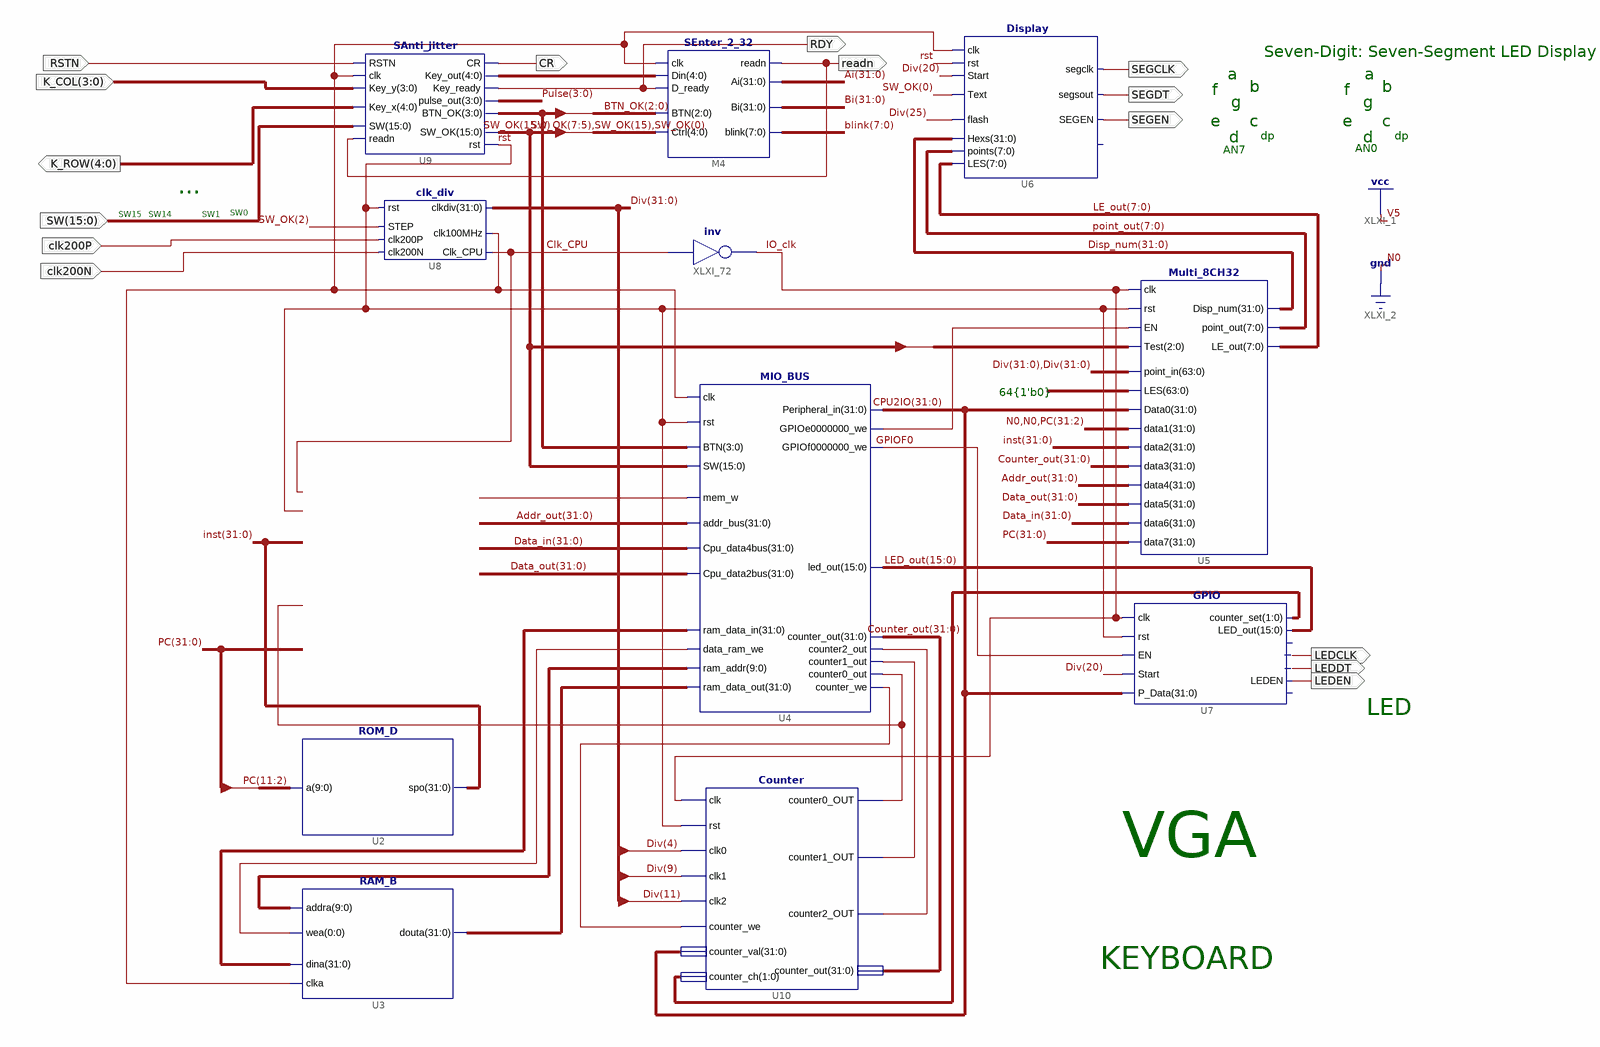
[diagram p0: schematic sheet 1]
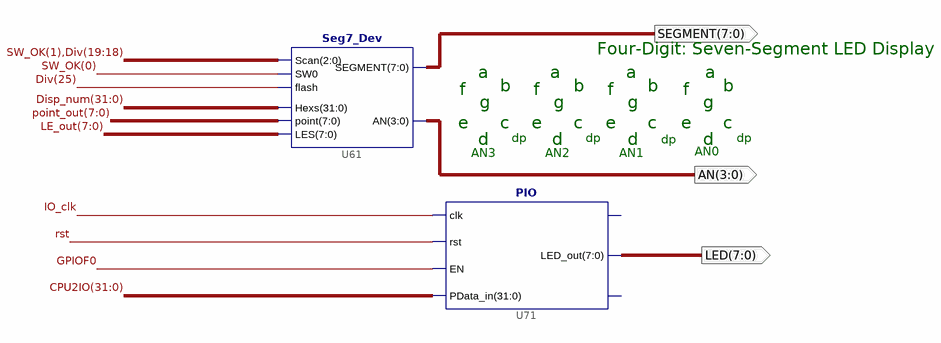
[diagram p1: schematic sheet 2]
// Xilinx ISE schematic OExp05_DataPath.sch (kintex7) as structural Verilog: 13 symbols, 18 ports
module OExp05_DataPath (
  input  [15:0] SW,
  input  [3:0] K_COL,
  input  RSTN,
  input  clk200P,
  input  clk200N,
  output [7:0] SEGMENT,
  output [3:0] AN,
  output readn,
  output RDY,
  output [4:0] K_ROW,
  output CR,
  output [7:0] LED,
  output LEDCLK,
  output LEDDT,
  output LEDEN,
  output SEGCLK,
  output SEGDT,
  output SEGEN
);

  wire clk_100mhz, Clk_CPU, GPIOF0, IO_clk, rst, XLXN_153, XLXN_154, XLXN_541, XLXN_544, XLXN_560, XLXN_579;
  wire [0:0] XLXN_557;
  wire [1:0] XLXN_219;
  wire [3:0] BTN_OK, Pulse;
  wire [4:0] XLXN_444;
  wire [7:0] blink, LE_out, point_out;
  wire [9:0] XLXN_558;
  wire [15:0] LED_out, SW_OK;
  wire [31:0] Addr_out, Ai, Bi, Counter_out, CPU2IO, Data_in, Data_out, Disp_num, Div, inst, PC, XLXN_556,
       XLXN_559;

  not XLXI_72 (IO_clk, Clk_CPU);
  ROM_D U2 (.a(PC[11:2]), .spo(inst));
  RAM_B U3 (.addra(XLXN_558), .clka(clk_100mhz), .wea(XLXN_557[0]), .dina(XLXN_556), .douta(XLXN_559));
  MIO_BUS U4 (
    .rst(rst), .clk(clk_100mhz), .mem_w(XLXN_544), .addr_bus(Addr_out), .Cpu_data4bus(Data_in),
    .Cpu_data2bus(Data_out), .ram_data_out(XLXN_559), .ram_addr(XLXN_558), .data_ram_we(XLXN_557[0]),
    .ram_data_in(XLXN_556), .counter_out(Counter_out), .counter2_out(XLXN_154), .counter1_out(XLXN_153),
    .counter0_out(XLXN_579), .counter_we(XLXN_560), .BTN(BTN_OK), .SW(SW_OK), .led_out(LED_out),
    .Peripheral_in(CPU2IO), .GPIOe0000000_we(XLXN_541), .GPIOf0000000_we(GPIOF0));
  Multi_8CH32 U5 (
    .Test(SW_OK[7:5]), .point_in({Div, Div}), .EN(XLXN_541), .clk(IO_clk), .rst(rst), .LES({64{1'b0}}),
    .Data0(CPU2IO), .data1({2'b00, PC[31:2]}), .data2(inst), .data3(Counter_out), .data4(Addr_out),
    .data5(Data_out), .data6(Data_in), .data7(PC), .point_out(point_out), .LE_out(LE_out), .Disp_num(Disp_num));
  Display U6 (
    .LES(LE_out), .SEGEN(SEGEN), .segsout(SEGDT), .points(point_out), .Hexs(Disp_num), .Text(SW_OK[0]),
    .flash(Div[25]), .segclk(SEGCLK), .clk(clk_100mhz), .rst(rst), .Start(Div[20]));  // open: segclrn
  GPIO U7 (
    .clk(IO_clk), .P_Data(CPU2IO), .rst(rst), .EN(GPIOF0), .Start(Div[20]), .ledclk(LEDCLK),
    .LED_out(LED_out), .counter_set(XLXN_219), .LEDEN(LEDEN), .ledsout(LEDDT));  // open: GPIOf0, ledclrn
  clk_div U8 (
    .clk200N(clk200N), .Clk_CPU(Clk_CPU), .rst(rst), .clkdiv(Div), .clk100MHz(clk_100mhz), .clk200P(clk200P),
    .STEP(SW_OK[2]));
  SAnti_jitter U9 (
    .SW(SW), .readn(readn), .Key_y(K_COL), .Key_x(K_ROW), .RSTN(RSTN), .clk(clk_100mhz), .Key_out(XLXN_444),
    .Key_ready(RDY), .CR(CR), .rst(rst), .SW_OK(SW_OK), .pulse_out(Pulse), .BTN_OK(BTN_OK));
  Counter U10 (
    .clk(IO_clk), .rst(rst), .clk0(Div[4]), .clk1(Div[9]), .clk2(Div[11]), .counter_we(XLXN_560),
    .counter_val(CPU2IO), .counter_ch(XLXN_219), .counter0_OUT(XLXN_579), .counter1_OUT(XLXN_153),
    .counter2_OUT(XLXN_154), .counter_out(Counter_out));
  SEnter_2_32 M4 (
    .readn(readn), .Ai(Ai), .Bi(Bi), .blink(blink), .Din(XLXN_444), .D_ready(RDY), .clk(clk_100mhz),
    .Ctrl({SW_OK[7:5], SW_OK[15], SW_OK[0]}), .BTN(BTN_OK[2:0]));
  Seg7_Dev U61 (
    .LES(LE_out), .Scan({SW_OK[1], Div[19:18]}), .SEGMENT(SEGMENT), .AN(AN), .point(point_out),
    .flash(Div[25]), .SW0(SW_OK[0]), .Hexs(Disp_num));
  PIO U71 (.clk(IO_clk), .rst(rst), .EN(GPIOF0), .PData_in(CPU2IO), .LED_out(LED));  // open: GPIOf0, counter_set

  // Notes on the sheet:
  //   Seven-Digit: Seven-Segment LED Display
  //   a
  //   a
  //   b
  //   b
  //   f
  //   f
  //   g
  //   g
  //   e
  //   c
  //   e
  //   c
  //   dp
  //   dp
  //   d
  //   d
  //   AN0
  //   AN7
  //   ...
  //   SW0
  //   SW15
  //   SW14
  //   SW1
  //   64{1'b0}
  //   LED
  //   VGA
  //   KEYBOARD
  //   Four-Digit: Seven-Segment LED Display
  //   a
  //   a
  //   a
  //   a
  //   b
  //   b
  //   b
  //   b
  //   f
  //   f
  //   f
  //   f
  //   g
  //   g
  //   g
  //   g
  //   e
  //   c
  //   e
  //   c
  //   e
  //   c
  //   e
  //   c
  //   dp
  //   dp
  //   dp
  //   d
  //   d
  //   d
  //   dp
  //   d
  //   AN0
  //   AN3
  //   AN2
  //   AN1
  //   LOC on signal SW(15:0) = K13,K14,J13,J14,H13,H14,G12,F12
endmodule
